# EAGLE design DigiGlove_conn_board (EAGLE 9.5.2)
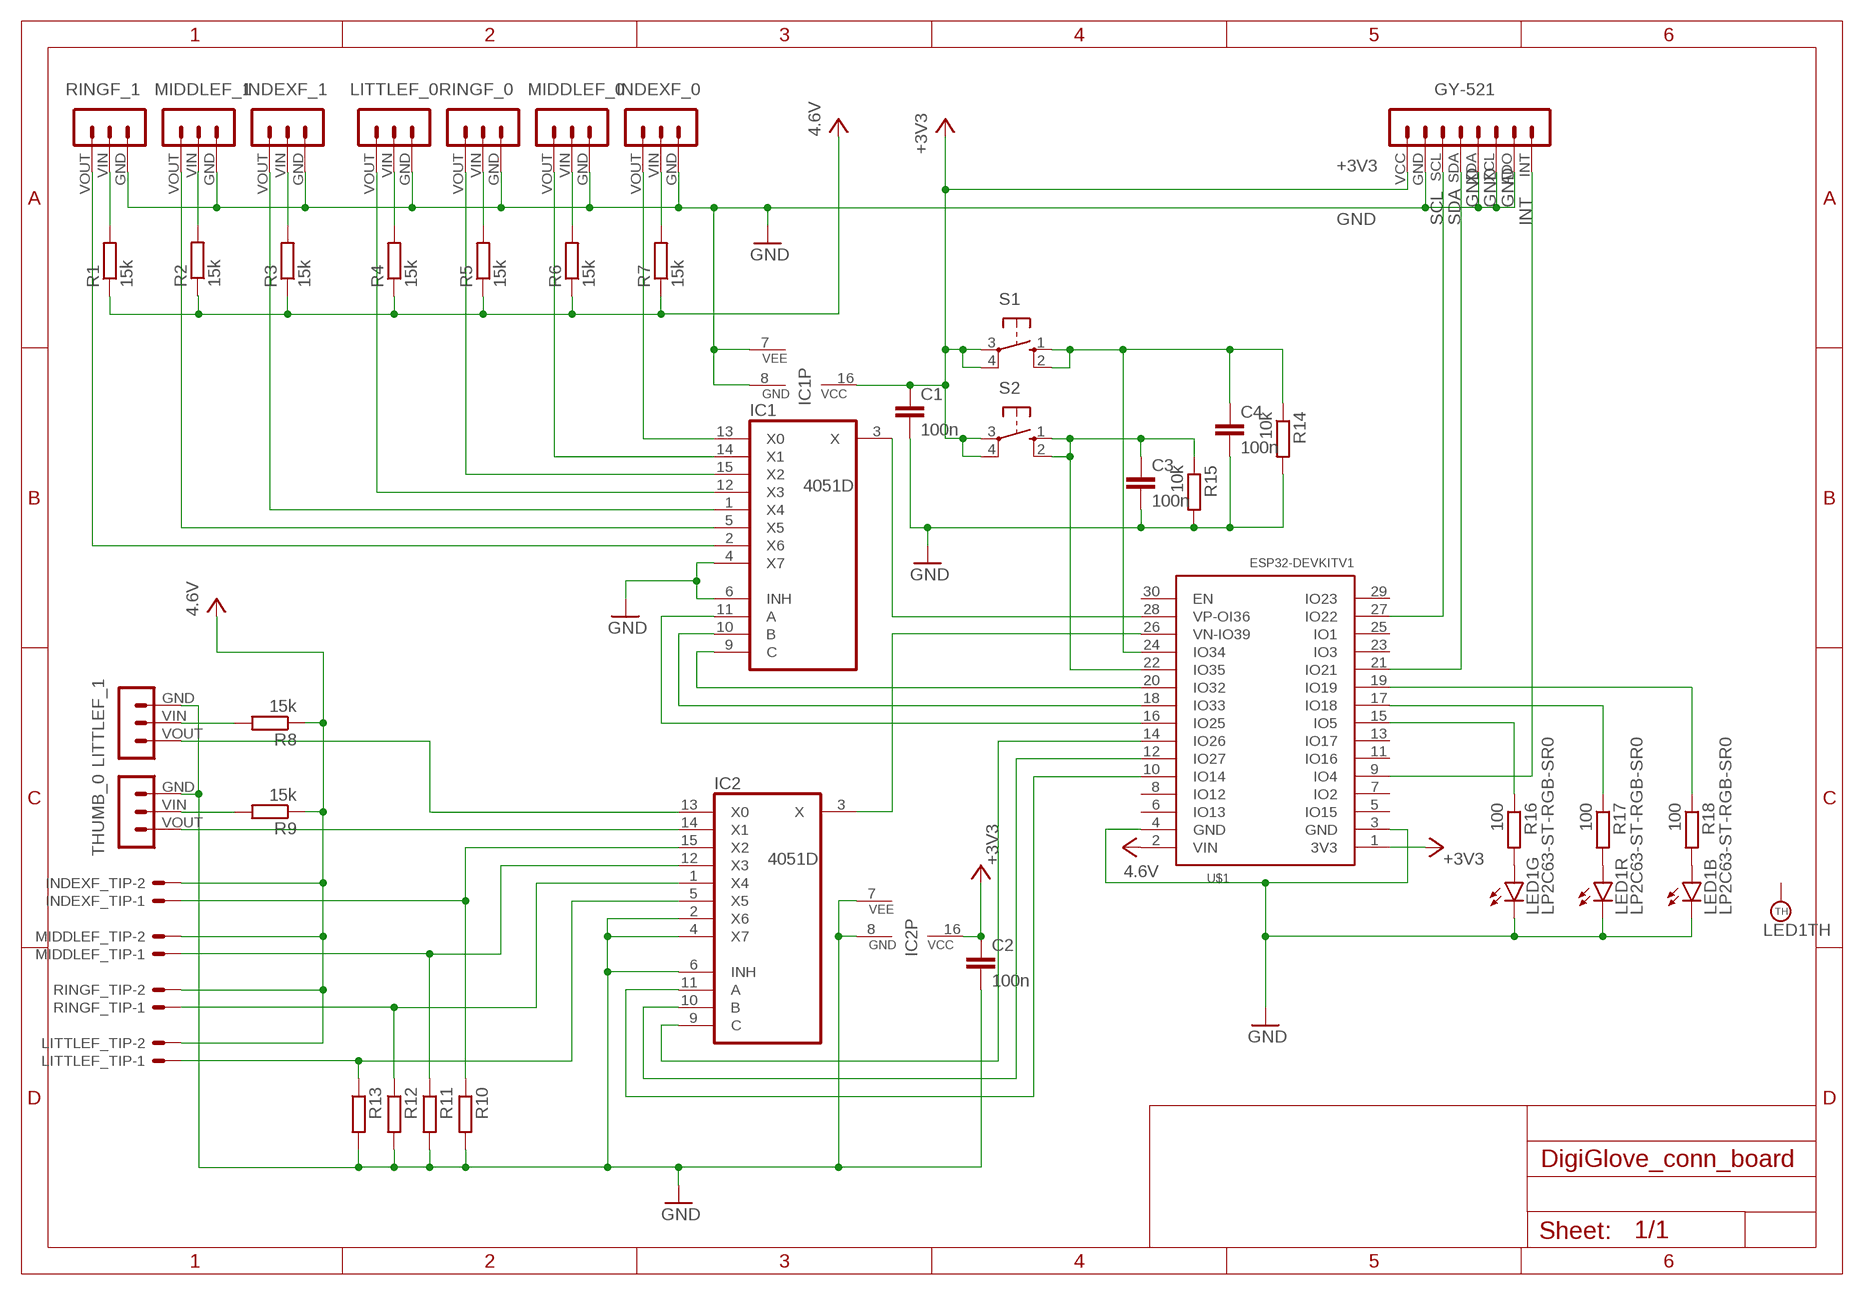
[diagram p0: schematic, sheet 1]

## Parts
C1  100n  C-EUC1608  [C1608]
C2  100n  C-EUC1608  [C1608]
C3  100n  C-EUC1608  [C1608]
C4  100n  C-EUC1608  [C1608]
GY-521  MA08-1MA08-1_254  [PAD8_254]
IC1  4051D  [SO16]
IC2  4051D  [SO16]
INDEXF_0  MA03-1MA03-1-254  [PAD3_254]
INDEXF_1  MA03-1MA03-1-254  [PAD3_254]
INDEXF_TIP  22-23-20212PIN_254  [PAD2_254]
LED1  LP2C63-ST-RGB-SR0  [LP2C63-ST-RGB-SR0]
LITTLEF_0  MA03-1MA03-1-254  [PAD3_254]
LITTLEF_1  MA03-1MA03-1-254  [PAD3_254]
LITTLEF_TIP  22-23-20212PIN_254  [PAD2_254]
MIDDLEF_0  MA03-1MA03-1-254  [PAD3_254]
MIDDLEF_1  MA03-1MA03-1-254  [PAD3_254]
MIDDLEF_TIP  22-23-20212PIN_254  [PAD2_254]
R1  15k  R-EU_R2012  [R2012]
R2  15k  R-EU_R2012  [R2012]
R3  15k  R-EU_R2012  [R2012]
R4  15k  R-EU_R2012  [R2012]
R5  15k  R-EU_R2012  [R2012]
R6  15k  R-EU_R2012  [R2012]
R7  15k  R-EU_R2012  [R2012]
R8  15k  R-EU_R2012  [R2012]
R9  15k  R-EU_R2012  [R2012]
R10  R-EU_R2012  [R2012]
R11  R-EU_R2012  [R2012]
R12  R-EU_R2012  [R2012]
R13  R-EU_R2012  [R2012]
R14  10k  R-EU_R2012  [R2012]
R15  10k  R-EU_R2012  [R2012]
R16  100  R-EU_R0603  [R0603]
R17  100  R-EU_R0603  [R0603]
R18  100  R-EU_R0603  [R0603]
RINGF_0  MA03-1MA03-1-254  [PAD3_254]
RINGF_1  MA03-1MA03-1-254  [PAD3_254]
RINGF_TIP  22-23-20212PIN_254  [PAD2_254]
S1  10-XX  [B3F-10XX]
S2  10-XX  [B3F-10XX]
THUMB_0  MA03-1MA03-1-254  [PAD3_254]
U$1  ESP32DEVKITV1HEADER  [MA17-2]

## Nets
+3V3: C1.1 C2.1 GY-521.VCC IC1.16(VCC) IC2.16(VCC) S1.3(P) S1.4(P1) S2.3(P) S2.4(P1) U$1.1(3V3)
GND: C1.2 C2.2 C3.2 C4.2 GY-521.ADO GY-521.GND GY-521.XCL GY-521.XDA IC1.4(X7) IC1.6(INH) IC1.7(VEE) IC1.8(GND) IC2.2(X6) IC2.4(X7) IC2.6(INH) IC2.7(VEE) IC2.8(GND) INDEXF_0.GND INDEXF_1.GND LED1.4(B:C) LED1.5(R:C) LED1.6(G:C) LITTLEF_0.GND LITTLEF_1.GND MIDDLEF_0.GND MIDDLEF_1.GND R10.2 R11.2 R12.2 R13.2 R14.2 R15.2 RINGF_0.GND RINGF_1.GND THUMB_0.GND U$1.3(GND) U$1.4(GND)
INT: GY-521.INT U$1.9(IO4)
N$1: IC1.13(X0) INDEXF_0.VOUT
N$2: IC1.14(X1) MIDDLEF_0.VOUT
N$3: IC1.15(X2) RINGF_0.VOUT
N$4: IC1.12(X3) LITTLEF_0.VOUT
N$5: IC1.1(X4) INDEXF_1.VOUT
N$6: IC1.5(X5) MIDDLEF_1.VOUT
N$7: IC1.2(X6) RINGF_1.VOUT
N$8: IC2.5(X5) LITTLEF_TIP.P$1 R13.1
N$9: IC2.1(X4) R12.1 RINGF_TIP.P$1
N$10: IC2.12(X3) MIDDLEF_TIP.P$1 R11.1
N$11: IC2.15(X2) INDEXF_TIP.P$1 R10.1
N$12: R1.2 RINGF_1.VIN
N$13: MIDDLEF_1.VIN R2.2
N$14: INDEXF_1.VIN R3.2
N$15: LITTLEF_0.VIN R4.2
N$16: R5.2 RINGF_0.VIN
N$17: MIDDLEF_0.VIN R6.2
N$18: INDEXF_0.VIN R7.2
N$19: IC2.14(X1) THUMB_0.VOUT
N$20: IC2.13(X0) LITTLEF_1.VOUT
N$21: R9.2 THUMB_0.VIN
N$22: LITTLEF_1.VIN R8.2
N$23: IC1.3(X) U$1.28(VP-OI36)
N$25: IC2.3(X) U$1.26(VN-IO39)
N$26: IC1.9(C) U$1.20(IO32)
N$27: IC1.10(B) U$1.18(IO33)
N$28: IC1.11(A) U$1.16(IO25)
N$29: C4.1 R14.1 S1.1(S) S1.2(S1) U$1.24(IO34)
N$30: IC2.9(C) U$1.14(IO26)
N$31: IC2.10(B) U$1.12(IO27)
N$32: IC2.11(A) U$1.10(IO14)
N$33: C3.1 R15.1 S2.1(S) S2.2(S1) U$1.22(IO35)
N$34: R16.1 U$1.15(IO5)
N$35: R17.1 U$1.17(IO18)
N$36: R18.1 U$1.19(IO19)
N$37: LED1.1(G:A) R16.2
N$38: LED1.2(R:A) R17.2
N$39: LED1.3(B:A) R18.2
SCL: GY-521.SCL U$1.27(IO22)
SDA: GY-521.SDA U$1.21(IO21)
VCC: INDEXF_TIP.P$2 LITTLEF_TIP.P$2 MIDDLEF_TIP.P$2 R1.1 R2.1 R3.1 R4.1 R5.1 R6.1 R7.1 R8.1 R9.1 RINGF_TIP.P$2 U$1.2(VIN) ; supply symbol labelled 4.6V
Unconnected: LED1.TH(TH:TH) U$1.5(IO15) U$1.6(IO13) U$1.7(IO2) U$1.8(IO12) U$1.11(IO16) U$1.13(IO17) U$1.23(IO3) U$1.25(IO1) U$1.29(IO23) U$1.30(EN)

## Library data of the parts
C1-C4 = rcl:C-EU: CAPACITOR, European symbol; SPICEPREFIX: C
GY-521 = DigiGlove_flex_strip_connector:MA08-1: PIN HEADER
IC1 IC2 = 40xx:4051: 8-channel ANALOG MULTIPLEXER
INDEXF_0 INDEXF_1 LITTLEF_0 LITTLEF_1 MIDDLEF_0 MIDDLEF_1 RINGF_0 RINGF_1 THUMB_0 = DigiGlove_flex_strip_connector:MA03-1: PIN HEADER
INDEXF_TIP LITTLEF_TIP MIDDLEF_TIP RINGF_TIP = DigiGlove_flex_strip_connector:22-23-2021: .100" (2.54mm) Center Header - 2 Pin
LED1 = led:LP2C63-ST-RGB-SR0: 1.5W RGB HIGH POWER LED Source: http://www.ledtech.com.tw .. LP2C63-ST-RGB-SR0.SPEC.pdf
R1-R18 = rcl:R-EU_: RESISTOR, European symbol; SPICEPREFIX: R
S1 S2 = switch-omron:10-XX: OMRON SWITCH; MPN: B3F-1000; OC_FARNELL: 176432; OC_NEWARK: 36M3542
U$1 = ESP32-DEVKITV1:ESP32DEVKITV1

## Board
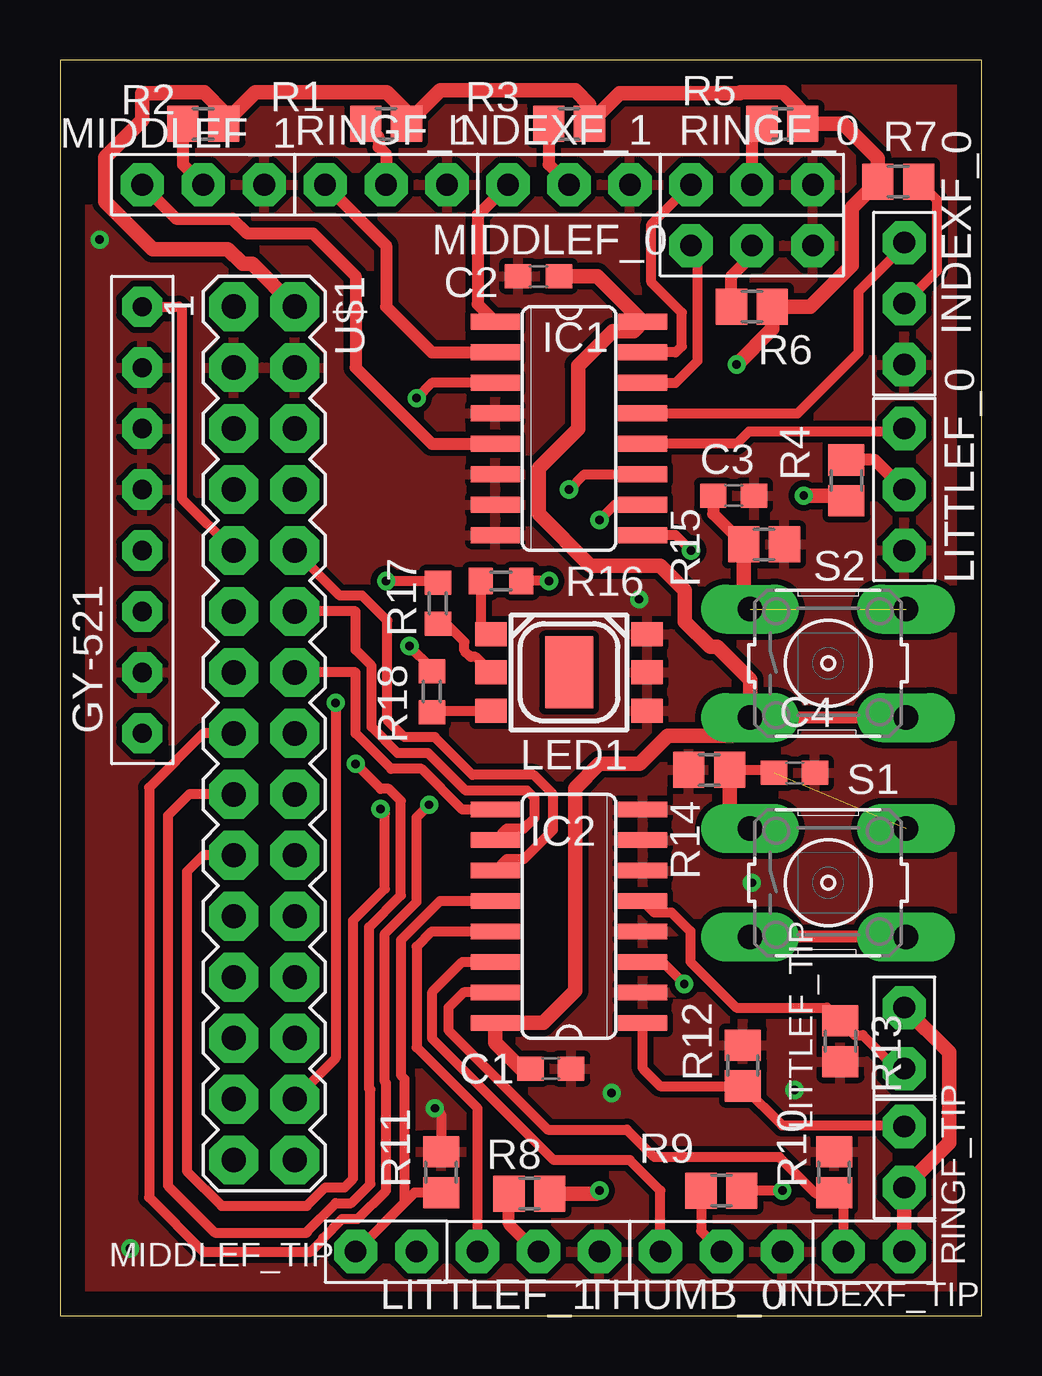
[diagram p1: board, top side]
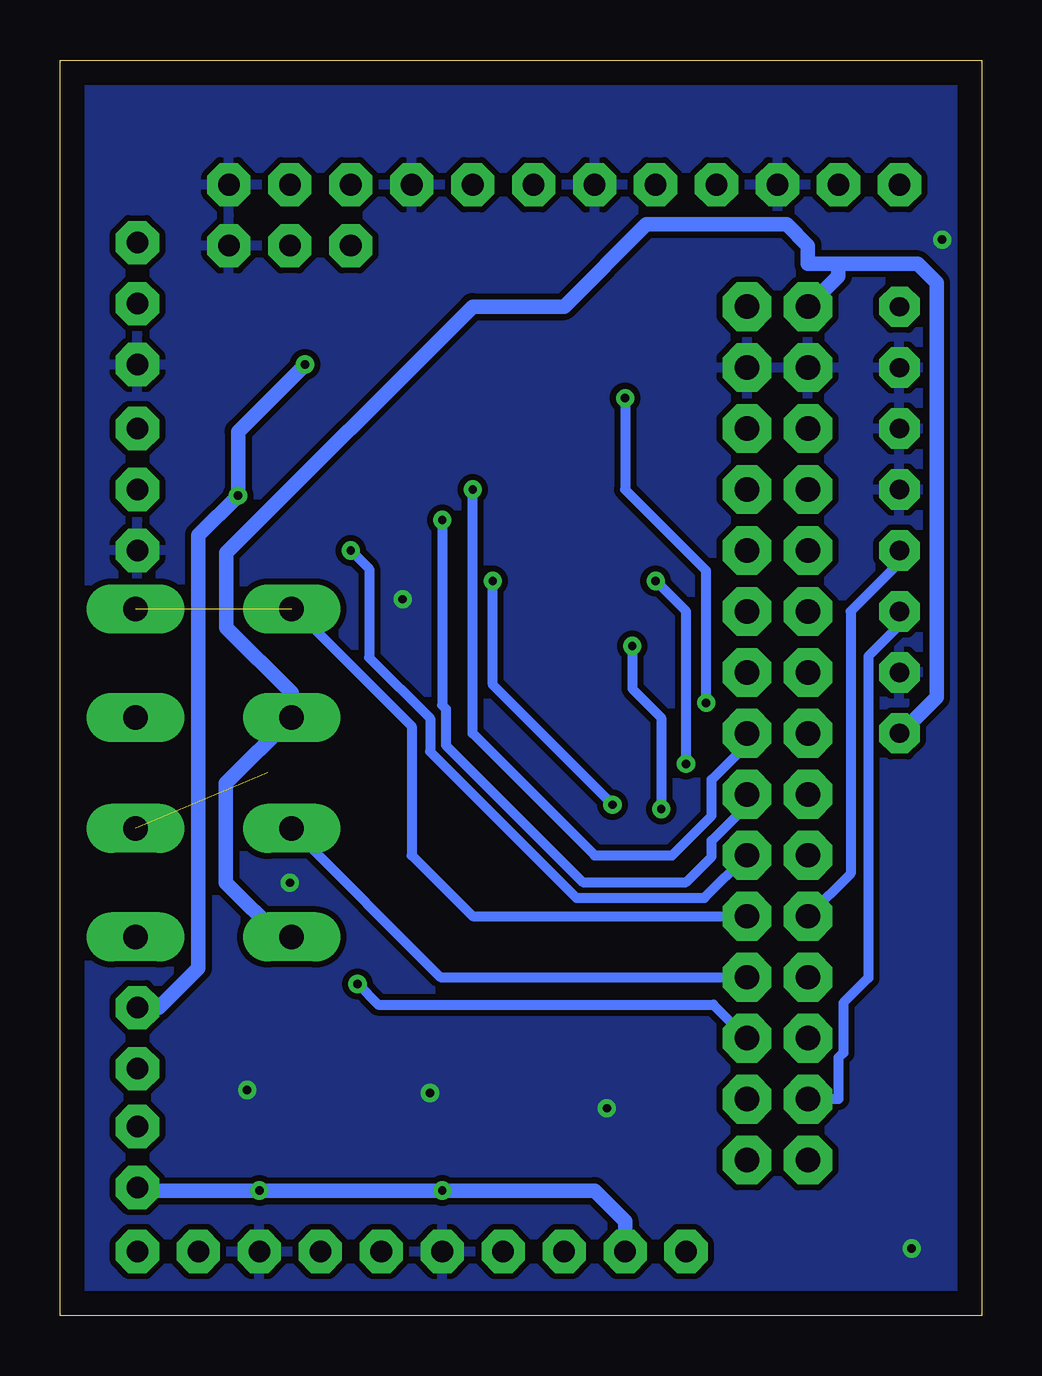
[diagram p2: board, bottom side, seen from below]

Size 38.41 x 52.31 mm. Coordinates in mm from the lower left corner, seen from the top.
Outline: 0,0 38.41,0 38.41,52.31 0,52.31 0,0
Copper layers (1*16): Top 0.035mm / dielectric 1.5mm / Bottom 0.035mm
Design rules "default *": minimum track width 10mil, minimum drill 0.3mm, track to track 10mil, track to pad 10mil, pad to pad 10mil, via to via 10mil, smd to smd 10mil, copper to edge 40mil, drill to drill 6mil, minimum pad ring 10mil, minimum via ring 8mil, stop-mask expansion 4mil, vias tented up to drill 0mil, thermal gap 10mil

### Footprints (pad centres in the part's own frame; a part is rotated, then mirrored left to right if it is on the bottom)
C1608 = smd 1.1 x 1: 1 -0.85,0; 2 0.85,0
PAD8_254 = drill 0.8 pad 1.676 octagon: ADO 15.24,0; GND 2.54,0; INT 17.78,0; SCL 5.08,0; SDA 7.62,0; VCC 0,0; XCL 12.7,0; XDA 10.16,0
SO16 = smd 0.66 x 2.032: 1 -4.445,-3.073; 2 -3.175,-3.073; 3 -1.905,-3.073; 4 -0.635,-3.073; 5 0.635,-3.073; 6 1.905,-3.073; 7 3.175,-3.073; 8 4.445,-3.073; 9 4.445,3.073; 10 3.175,3.073; 11 1.905,3.073; 12 0.635,3.073; 13 -0.635,3.073; 14 -1.905,3.073; 15 -3.175,3.073; 16 -4.445,3.073
PAD3_254 = drill 0.9 pad 1.676 octagon: GND 5.08,0; VIN 2.54,0; VOUT 0,0
PAD2_254 = drill 0.9 pad 1.676 octagon: P$1 0,0; P$2 2.54,0
LP2C63-ST-RGB-SR0 = smd 1.3 x 1: 1 -3.25,1.6; 2 -3.25,0; 3 -3.25,-1.6; 4 3.25,-1.6; 5 3.25,0; 6 3.25,1.6 | smd 2 x 3: TH 0,0
R2012 = smd 1.3 x 1.5: 1 -0.85,0; 2 0.85,0
R0603 = smd 1 x 1.1: 1 -0.85,0; 2 0.85,0
B3F-10XX = drill 1.016 long: 1 -3.251,2.261; 2 3.251,2.261; 3 -3.251,-2.261; 4 3.251,-2.261
MA17-2 = drill 1.016 octagon: 1 -20.32,-1.27; 2 -20.32,1.27; 3 -17.78,-1.27; 4 -17.78,1.27; 5 -15.24,-1.27; 6 -15.24,1.27; 7 -12.7,-1.27; 8 -12.7,1.27; 9 -10.16,-1.27; 10 -10.16,1.27; 11 -7.62,-1.27; 12 -7.62,1.27; 13 -5.08,-1.27; 14 -5.08,1.27; 15 -2.54,-1.27; 16 -2.54,1.27; 17 0,-1.27; 18 0,1.27; 19 2.54,-1.27; 20 2.54,1.27; 21 5.08,-1.27; 22 5.08,1.27; 23 7.62,-1.27; 24 7.62,1.27; 25 10.16,-1.27; 26 10.16,1.27; 27 12.7,-1.27; 28 12.7,1.27; 29 15.24,-1.27; 30 15.24,1.27

### Placement (x,y rotation side)
C1  20.45,10.29 0 top
C2  19.94,43.31 180 top
C3  28.07,34.16 0 top
C4  30.61,22.61 0 top
GY-521  3.43,24.26 90 top
IC1  21.21,36.96 270 top
IC2  21.21,16.64 90 top
INDEXF_0  35.18,44.7 270 top
INDEXF_1  18.67,47.12 0 top
INDEXF_TIP  32.64,2.67 0 top
LED1  21.21,26.8 0 top
LITTLEF_0  35.18,36.96 270 top
LITTLEF_1  17.4,2.67 0 top
LITTLEF_TIP  35.18,10.29 90 top
MIDDLEF_0  26.29,44.58 0 top
MIDDLEF_1  3.43,47.12 0 top
MIDDLEF_TIP  12.32,2.67 0 top
R1  13.59,49.66 180 top
R2  5.97,49.66 180 top
R3  21.21,49.66 180 top
R4  32.77,34.8 90 top
R5  30.1,49.66 180 top
R6  28.83,42.04 180 top
R7  34.92,47.24 0 top
R8  19.56,5.08 180 top
R9  27.56,5.21 180 top
R10  32.26,5.97 90 top
R11  15.88,5.97 90 top
R12  28.45,10.41 90 top
R13  32.51,11.43 270 top
R14  27.05,22.73 180 top
R15  29.34,32.13 0 top
R16  18.38,30.61 180 top
R17  15.75,29.68 270 top
R18  15.49,26 270 top
RINGF_0  26.29,47.12 0 top
RINGF_1  11.05,47.12 0 top
RINGF_TIP  35.18,7.87 270 top
S1  32,18.03 0 top
S2  32,27.18 0 top
THUMB_0  25.02,2.67 0 top
U$1  8.51,21.72 270 top

### Tracks (layer width: path | path; a pad name or v marks a point on that pad's centre or on a via)
+3V3
  Top 0.508: S1.4 S1.3 | S2.4 S2.3 | IC1.16 24.28,41.3
  Top 0.61: C1.1 19.22,10.29 18.14,11.37 IC2.16 20.13,12.19 21.46,13.53 21.46,21.97 22.48,22.99 24.16,22.99 25.32,24.15 27.99,24.15 S2.3 28.75,26.49 27.38,27.86 27.08,27.86 26.04,28.91 26.04,30.23 25.02,31.24 22.1,31.24 19.94,33.4 19.94,35.31 21.59,36.96 21.59,39.58 23.04,41.02 23.9,41.02 IC1.16 22.38,43.31 C2.1
  Bottom 0.61: S1.3 29.23,15.77 31.5,18.03 31.5,22.17 S2.3 28.75,25.94 31.47,28.66 31.47,31.77 21.21,42.04 17.4,42.04 13.97,45.47 8.13,45.47 7.24,44.58 7.24,43.82 5.97,43.82 | 5.97,43.82 5.97,43.31 U$1.1 | GY-521.VCC 3.38,24.26 1.88,25.75 1.88,43.03 2.67,43.82 5.97,43.82
GND  (via drill 0.35)
  Top 0.406: v15.62,8.64 15.88,8.38 R11.2
  other vias: 30.61,9.4 28.83,18.03 2.92,2.79 1.65,44.83 22.99,9.27 24.13,29.84
  pour Top: 0,0.13 0,52.2 38.1,52.2 38.1,0.13
  pour Bottom: 0,0.13 0,52.2 38.1,52.2 38.1,0.13
INT
  Top 0.406: GY-521.INT 4.95,42.04 5.08,41.91 5.08,34.04 U$1.9
N$1
  Top 0.406: IC1.13 30.73,37.59 33.27,40.13 33.27,42.67 35.18,44.58 INDEXF_0.VOUT
N$2
  Top 0.406: IC1.14 25.65,38.86 26.57,39.78 26.57,44.3 MIDDLEF_0.VOUT
N$3
  Top 0.406: IC1.15 25.65,40.13 25.91,40.39 25.91,41.78 24.64,43.05 24.64,45.47 RINGF_0.VOUT
N$4
  Top 0.406: IC1.12 28.19,36.32 28.7,36.83 35.05,36.83 LITTLEF_0.VOUT
N$5
  Top 0.508: INDEXF_1.VOUT 17.4,45.85 17.4,42.14 IC1.1
N$6
  Top 0.508: MIDDLEF_1.VOUT 4.84,45.71 7.18,45.71 7.81,45.09 10.54,45.09 12.32,43.31 12.32,39.5 15.49,36.32 IC1.5
N$7
  Top 0.508: RINGF_1.VOUT 13.59,44.58 13.59,42.04 15.49,40.13 IC1.2
N$8
  Top 0.406: IC2.5 24.77,16.79 25.49,16.79 26.26,16.01 26.26,14.74 28.18,12.83 31.96,12.83 R13.1 33.1,11.69 33.45,11.69 34.85,10.29 LITTLEF_TIP.P$1
N$9
  Top 0.406: IC2.1 24.28,10.29 25,9.56 R12.1 30.09,7.93 35.13,7.93 RINGF_TIP.P$1
N$10
  Top 0.406: R11.1 14.77,5.12 MIDDLEF_TIP.P$1 14.35,4.7 14.35,9.86 14.2,10.01 14.2,15.64 15.83,17.27 IC2.12
N$11
  Top 0.406: IC2.15 16.82,13.46 16.18,12.83 16.18,11.89 20.32,7.75 23.62,7.75 24.77,6.6 29.97,6.6 31.5,5.08 32.22,5.08 R10.1 32.64,4.74 INDEXF_TIP.P$1
N$12
  Top 0.508: R1.2 13.28,49.12 13.28,48.7 13.59,48.39 RINGF_1.VIN
N$13
  Top 0.508: R2.2 5.12,47.97 MIDDLEF_1.VIN
N$14
  Top 0.508: R3.2 20.36,47.97 INDEXF_1.VIN
N$15
  Top 0.508: LITTLEF_0.VIN 33.95,35.65 R4.2
N$16
  Top 0.508: R5.2 28.83,49.24 RINGF_0.VIN
N$17
  Top 0.508: MIDDLEF_0.VIN 28.83,44.16 27.98,43.31 R6.2
N$18
  Top 0.406: R7.2 36.54,46.48 36.54,43.52 INDEXF_0.VIN
N$19
  Top 0.406: IC2.14 16.76,14.73 15.52,13.49 15.52,11.53 20.57,6.48 23.75,6.48 25.02,5.21 THUMB_0.VOUT
N$20
  Top 0.406: LITTLEF_1.VOUT 17.4,8.64 14.86,11.18 14.86,15.37 15.49,16 IC2.13
N$21
  Top 0.406: R9.2 26.71,3.52 THUMB_0.VIN
N$22
  Top 0.508: LITTLEF_1.VIN 19.85,2.67 18.71,3.81 R8.2
N$23  (via drill 0.35)
  Top 0.406: IC1.3 15.49,38.86 v14.86,38.23 | v11.48,25.53 11.48,10.72 U$1.28
  Bottom 0.406: v14.86,38.23 14.86,34.42 11.48,31.04 v11.48,25.53
N$25  (via drill 0.35)
  Top 0.406: v26.01,13.82 25.09,14.73 IC2.3
  Bottom 0.406: U$1.26 11.18,12.95 25.15,12.95 v26.01,13.82
N$26  (via drill 0.35)
  Top 0.406: v26.29,31.88 25.65,32.51 IC1.9
  Bottom 0.406: U$1.20 11.56,17.4 16.89,17.4 22.99,23.49 22.99,24.88 25.53,27.42 25.53,31.11 v26.29,31.88
N$27  (via drill 0.35)
  Top 0.406: v22.48,33.15 23.11,33.78 IC1.10
  Bottom 0.406: U$1.18 9.78,21.26 11.25,19.79 11.25,19.13 12.32,18.06 16.62,18.06 22.33,23.77 22.33,25.28 22.48,25.43 v22.48,33.15
N$28  (via drill 0.35)
  Top 0.406: v21.21,34.42 21.84,35.05 IC1.11
  Bottom 0.406: v21.21,34.42 21.21,24.26 16.13,19.18 12.9,19.18 11.25,20.83 11.25,22.33 9.78,23.8 U$1.16
N$29  (1 unrouted)
  Top 0.406: R14.1 29.63,22.73 C4.1
  Top 0.61: R14.1 27.9,21.15 S1.1
  Bottom 0.406: S1.1 22.55,14.1 U$1.24
N$30
  Top 0.406: IC2.9 16.76,21.08 15.07,22.78 13.8,22.78 12.32,24.26 12.32,26.8 U$1.14
N$31
  Top 0.406: IC2.10 18.62,20.29 19.34,20.29 19.78,20.73 19.78,21.55 19.46,21.87 16.91,21.87 15.34,23.44 14.07,23.44 12.98,24.53 12.98,27.07 12.32,27.73 12.32,29.34 U$1.12
N$32
  Top 0.406: IC2.11 18.62,19.02 19.34,19.02 20.55,20.23 20.55,21.72 19.74,22.53 17.18,22.53 15.62,24.1 14.35,24.1 13.64,24.8 13.64,28.95 12.59,30 11.66,30 U$1.10
N$33  (1 unrouted)
  Top 0.508: C3.1 27.22,33.4 R15.1
  Top 0.61: R15.1 28.49,29.7 S2.1
  Bottom 0.406: 28.63,29.44 23.75,24.56 23.75,19.18 21.21,16.64 U$1.22
  Bottom 0.61: S2.1 28.63,29.44
N$34  (via drill 0.35)
  Top 0.406: U$1.15 5.97,24.26 3.71,22 3.71,4.93 5.97,2.67 10.45,2.67 10.96,3.18 10.96,3.23 11.76,4.02 12.41,4.02 13.59,5.21 13.59,9.69 13.54,9.74 13.54,15.91 14.86,17.23 14.86,20.76 v15.38,21.28 | v20.37,30.61 R16.1
  Bottom 0.406: v15.38,21.28 20.37,26.27 v20.37,30.61
N$35  (via drill 0.35)
  Top 0.406: U$1.17 5.38,21.72 4.5,20.83 4.5,5.41 6.45,3.45 10.3,3.45 10.3,3.5 11.48,4.68 12.13,4.68 12.93,5.48 12.93,9.42 12.88,9.47 12.88,16.19 14.2,17.51 14.2,21.44 13.7,21.94 13.36,21.94 v12.32,22.99 | v13.59,30.61 15.67,30.61 R17.1
  Bottom 0.406: v12.32,22.99 12.32,29.34 v13.59,30.61
N$36  (via drill 0.35)
  Top 0.406: U$1.19 5.97,19.18 5.28,18.49 5.28,6.02 6.73,4.57 10.29,4.57 11.06,5.34 11.86,5.34 12.22,5.7 12.22,16.46 13.54,17.78 13.54,20.92 v13.35,21.11 | R18.1 15.49,26.96 v14.56,27.9
  Bottom 0.406: v14.56,27.9 14.56,26.12 13.35,24.92 v13.35,21.11
N$37
  Top 0.406: R16.2 17.53,28.83 LED1.1
N$38
  Top 0.406: LED1.2 17.32,27.44 17.12,27.44 16.85,27.71 16.85,28.07 16.09,28.83 R17.2
N$39
  Top 0.406: R18.2 15.54,25.2 LED1.3
SCL
  Bottom 0.406: GY-521.SCL 3.43,28.76 4.72,27.46 4.72,14.07 5.77,13.03 5.77,10.95 5.97,10.74 5.97,9.02 U$1.27
SDA
  Bottom 0.406: GY-521.SDA 3.43,31.37 5.46,29.34 5.46,18.41 U$1.21
VCC  (via drill 0.35)
  Top 0.406: v30.1,5.21 R9.1 | v22.48,5.21 22.35,5.08 | 32.55,34.16 R4.1
  Top 0.61: U$1.2 8,43.82 7.62,43.82 7,44.44 3.86,44.44 1.89,46.41 1.89,48.26 3.43,49.8 3.43,50.93 4.2,50.93 4.24,50.97 6,50.97 6.82,50.15 R2.1 8.13,50.97 13.62,50.97 14.44,50.15 R1.1 15.84,51.05 21.46,51.05 22.06,50.46 R3.1 23.33,50.93 28.33,50.93 28.37,50.97 30.13,50.97 31.37,49.73 31.37,49.66 | LITTLEF_TIP.P$2 37.04,10.96 37.04,7.2 RINGF_TIP.P$2 INDEXF_TIP.P$2 | 22.35,5.08 R8.1 | R5.1 31.37,49.66 | 31.37,49.66 32.64,49.66 34.08,48.22 R7.1 32.98,46.15 32.98,43.76 31.26,42.04 R6.1 29.68,41.11 v28.19,39.62 | v30.99,34.16 32.55,34.16
  Bottom 0.406: RINGF_TIP.P$2 35.05,5.21
  Bottom 0.61: 35.05,5.21 v30.1,5.21 v22.48,5.21 16.13,5.21 14.86,3.94 MIDDLEF_TIP.P$2 | v28.19,39.62 30.99,36.83 v30.99,34.16 32.64,32.51 32.64,14.48 34.29,12.83 LITTLEF_TIP.P$2